# Altium schematic sheet sheet4_buttons_and_leds.SchDoc: Buttons and LEDs
size A3; Organization: Nordic Semiconductor; DocumentNumber: 4; SheetNumber: 4; SheetTotal: 6; CompanyName: Nordic Semiconductor; DocumentSize: A3
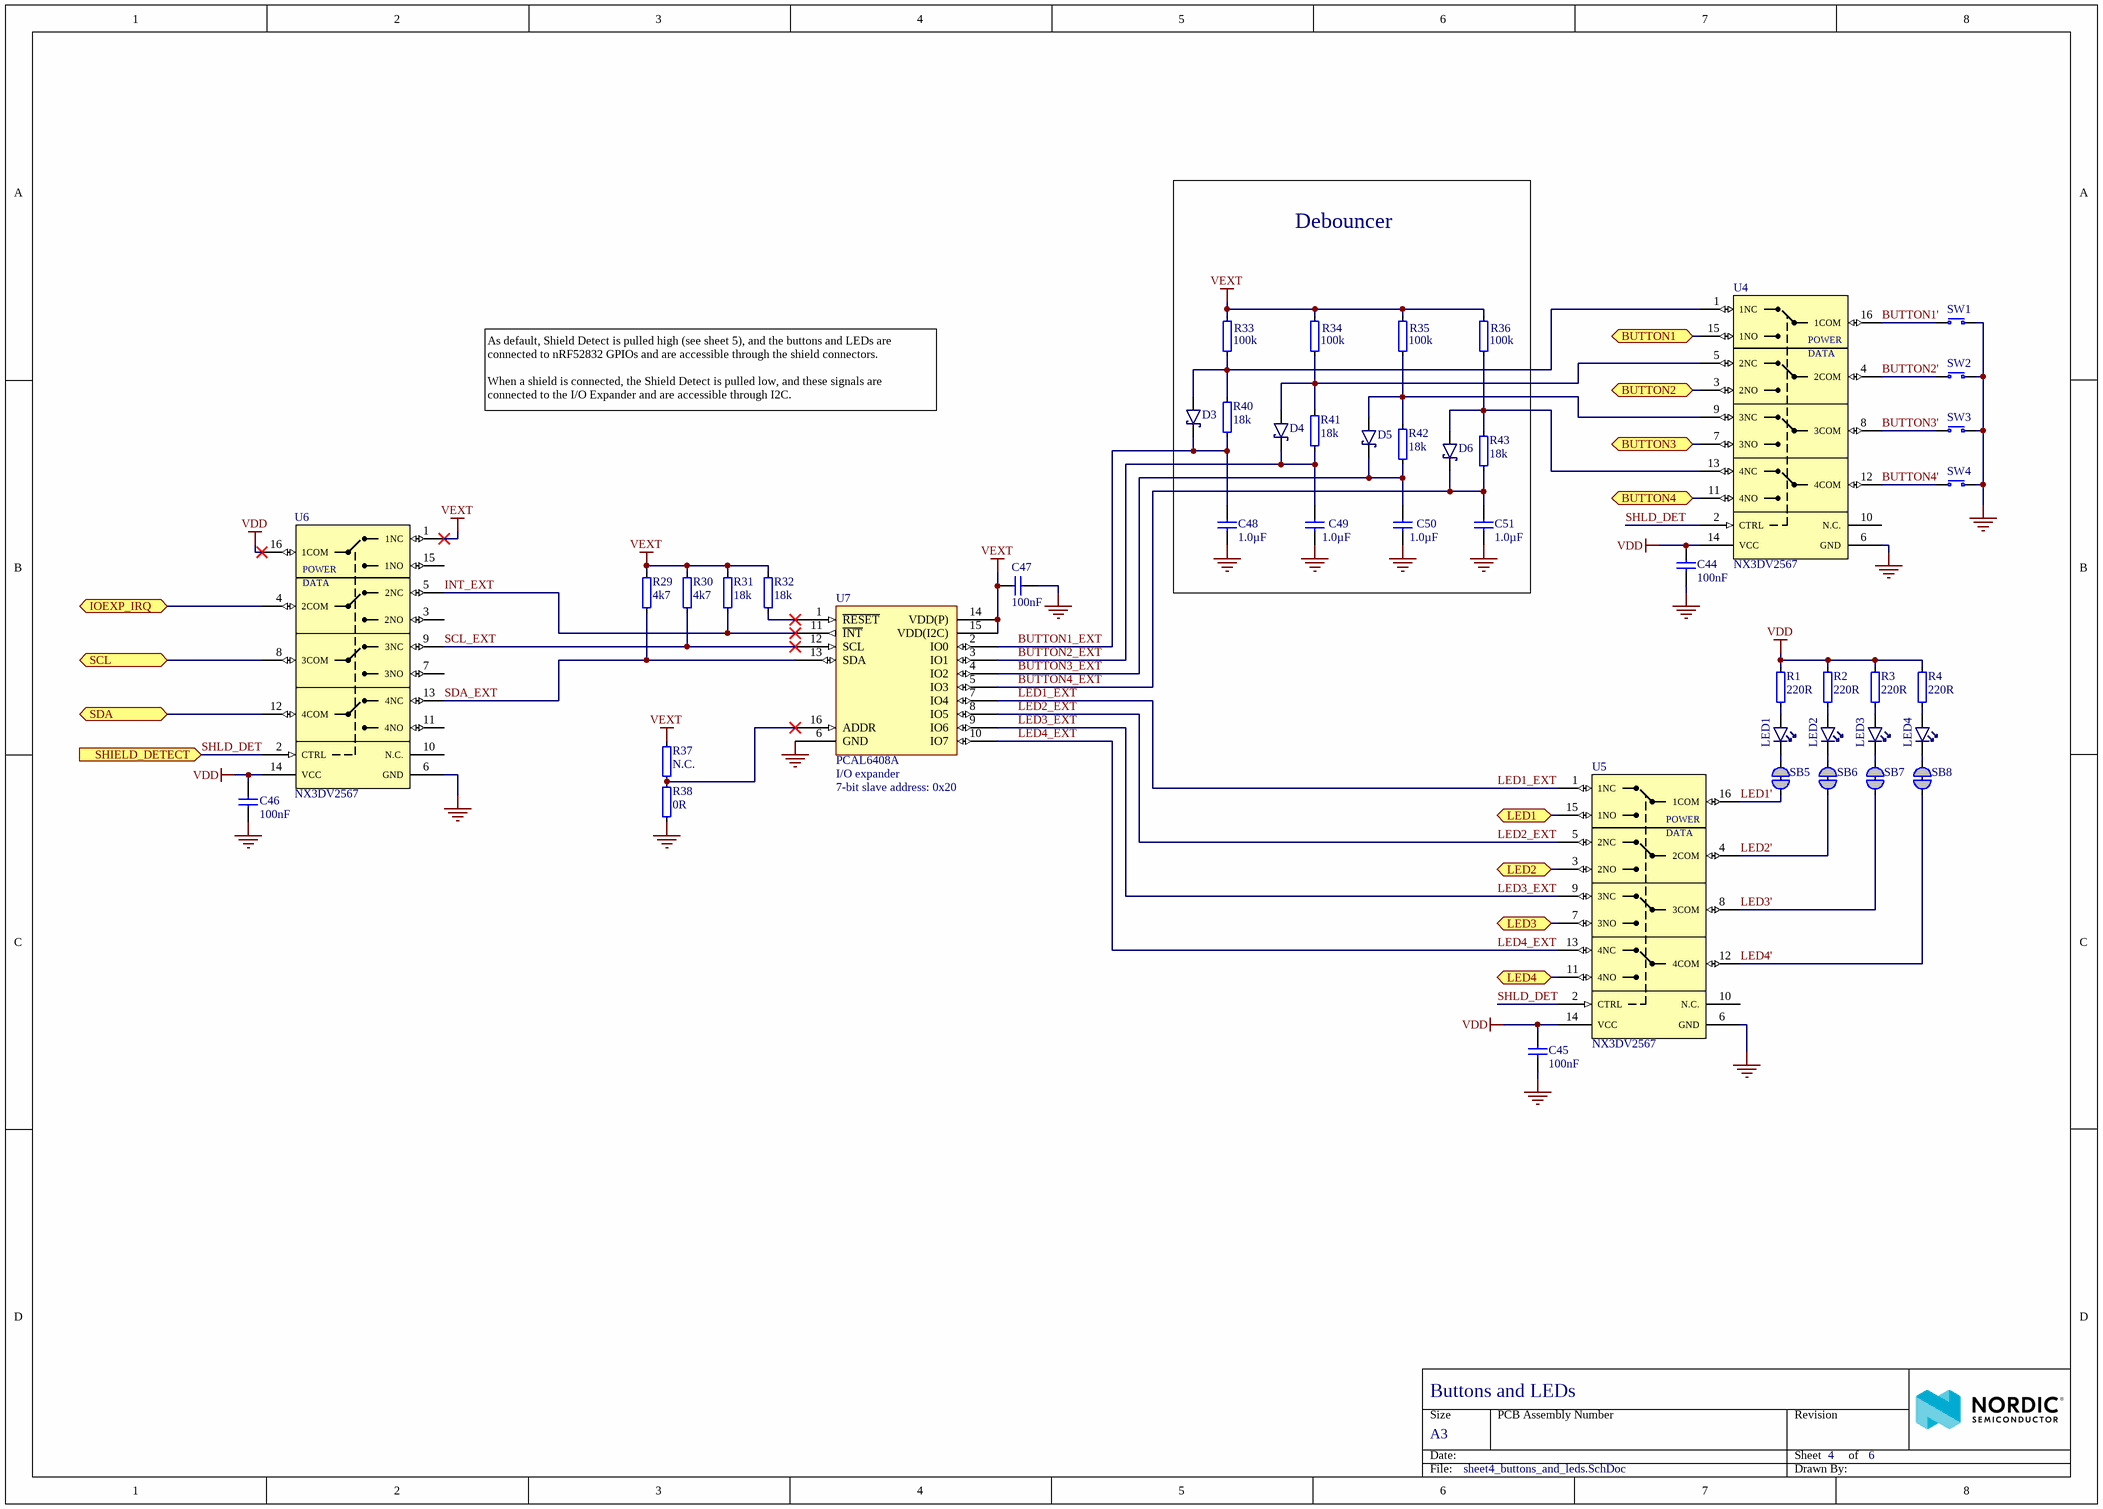
[diagram p0: sheet4_buttons_and_leds.SchDoc]

## Parts
C44  100nF  [CAPC1005X04L]
C45  100nF  [CAPC1005X04L]
C46  100nF  [CAPC1005X04L]
C47  100nF  [CAPC1005X04L]
C48  1.0µF  [CAPC1005X04L]
C49  1.0µF  [CAPC1005X04L]
C50  1.0µF  [CAPC1005X04L]
C51  1.0µF  [CAPC1005X04L]
D3  1PS79SB30.115  [SOD-523]  (value not drawn)
D4  1PS79SB30.115  [SOD-523]  (value not drawn)
D5  1PS79SB30.115  [SOD-523]  (value not drawn)
D6  1PS79SB30.115  [SOD-523]  (value not drawn)
LED1  L0603G  [LED_0603_G]  (value not drawn)
LED2  L0603G  [LED_0603_G]  (value not drawn)
LED3  L0603G  [LED_0603_G]  (value not drawn)
LED4  L0603G  [LED_0603_G]  (value not drawn)
R1  220R  [RESC1005X04L]
R2  220R  [RESC1005X04L]
R3  220R  [RESC1005X04L]
R4  220R  [RESC1005X04L]
R29  4k7  [RESC1005X04L]
R30  4k7  [RESC1005X04L]
R31  18k  [RESC1005X04L]
R32  18k  [RESC1005X04L]
R33  100k  [RESC1005X04L]
R34  100k  [RESC1005X04L]
R35  100k  [RESC1005X04L]
R36  100k  [RESC1005X04L]
R37  N.C.  [RESC1005X04L_NC]
R38  0R  [RESC1005X04L]
R40  18k  [RESC1005X04L]
R41  18k  [RESC1005X04L]
R42  18k  [RESC1005X04L]
R43  18k  [RESC1005X04L]
SB5  Solderbridge  [Solderbridge_Shorted]  (value not drawn)  (net tie, no BOM)
SB6  Solderbridge  [Solderbridge_Shorted]  (value not drawn)  (net tie, no BOM)
SB7  Solderbridge  [Solderbridge_Shorted]  (value not drawn)  (net tie, no BOM)
SB8  Solderbridge  [Solderbridge_Shorted]  (value not drawn)  (net tie, no BOM)
SW1  PB SW  [Switch-PB-6.2x6.3mm-SMD]  (value not drawn)
SW2  PB SW  [Switch-PB-6.2x6.3mm-SMD]  (value not drawn)
SW3  PB SW  [Switch-PB-6.2x6.3mm-SMD]  (value not drawn)
SW4  PB SW  [Switch-PB-6.2x6.3mm-SMD]  (value not drawn)
U4  NX3DV2567  [XQFN40P180X260X50-16N]
U5  NX3DV2567  [XQFN40P180X260X50-16N]
U6  NX3DV2567  [XQFN40P180X260X50-16N]
U7  PCAL6408A  [XQFN40P180X260X50-16N]

## Blocks framed on the sheet
Debouncer: C48-C51 D3-D6 R33-R36 R40-R43

## Ports
BUTTON1 (bidir), BUTTON2 (bidir), BUTTON3 (bidir), BUTTON4 (bidir), IOEXP_IRQ (bidir), LED1 (bidir), LED2 (bidir), LED3 (bidir), LED4 (bidir), SCL (bidir), SDA (bidir), SHIELD_DETECT (in)

## Nets
GND: C44.1 C45.1 C46.1 C47.1 C48.2 C49.1 C50.1 C51.2 R38.1 SW1.1(N.O) SW2.1(N.O) SW3.1(N.O) SW4.1(N.O) U4.6(GND) U5.6(GND) U6.6(GND) U7.6(GND)
VDD: C44.2 C45.2 C46.2 R1.2 R2.2 R3.2 R4.2 U4.14(VCC) U5.14(VCC) U6.14(VCC) U6.16(1COM)
VEXT: C47.2 R29.2 R30.2 R31.2 R32.2 R33.2 R34.2 R35.2 R36.2 R37.2 U6.1(1NC) U7.14(VDD(P)) U7.15(VDD(I2C))
BUTTON1: U4.15(1NO) ; port BUTTON1
BUTTON1': SW1.2(COM) U4.16(1COM)
BUTTON1_EXT: C48.1 D3.3(C) R40.1 U7.2(IO0)
BUTTON2: U4.3(2NO) ; port BUTTON2
BUTTON2': SW2.2(COM) U4.4(2COM)
BUTTON2_EXT: C49.2 D4.3(C) R41.1 U7.3(IO1)
BUTTON3: U4.7(3NO) ; port BUTTON3
BUTTON3': SW3.2(COM) U4.8(3COM)
BUTTON3_EXT: C50.2 D5.3(C) R42.1 U7.4(IO2)
BUTTON4: U4.11(4NO) ; port BUTTON4
BUTTON4': SW4.2(COM) U4.12(4COM)
BUTTON4_EXT: C51.1 D6.3(C) R43.1 U7.5(IO3)
INT_EXT: R31.1 U6.5(2NC) U7.11(~{INT})
IOEXP_IRQ: U6.4(2COM) ; port IOEXP_IRQ
LED1: U5.15(1NO) ; port LED1
LED1': SB5.1 U5.16(1COM)
LED1_EXT: U5.1(1NC) U7.7(IO4)
LED2: U5.3(2NO) ; port LED2
LED2': SB6.1 U5.4(2COM)
LED2_EXT: U5.5(2NC) U7.8(IO5)
LED3: U5.7(3NO) ; port LED3
LED3': SB7.1 U5.8(3COM)
LED3_EXT: U5.9(3NC) U7.9(IO6)
LED4: U5.11(4NO) ; port LED4
LED4': SB8.1 U5.12(4COM)
LED4_EXT: U5.13(4NC) U7.10(IO7)
SCL: U6.8(3COM) ; port SCL
SCL_EXT: R30.1 U6.9(3NC) U7.12(SCL)
SDA: U6.12(4COM) ; port SDA
SDA_EXT: R29.1 U6.13(4NC) U7.13(SDA)
SHLD_DET: U4.2(CTRL) U5.2(CTRL) U6.2(CTRL) ; port SHIELD_DETECT
NetD3_1: D3.1(A) R33.1 R40.2 U4.1(1NC)
NetD4_1: D4.1(A) R34.1 R41.2 U4.5(2NC)
NetD5_1: D5.1(A) R35.1 R42.2 U4.9(3NC)
NetD6_1: D6.1(A) R36.1 R43.2 U4.13(4NC)
NetLED1_1: LED1.1(C) SB5.2
NetLED1_2: LED1.2(A) R1.1
NetLED2_1: LED2.1(C) SB6.2
NetLED2_2: LED2.2(A) R2.1
NetLED3_1: LED3.1(C) SB7.2
NetLED3_2: LED3.2(A) R3.1
NetLED4_1: LED4.1(C) SB8.2
NetLED4_2: LED4.2(A) R4.1
NetR32_1: R32.1 U7.1(~{RESET})
NetR37_1: R37.1 R38.2 U7.16(ADDR)

Not connected (* = marked no-connect by the designer): U4 10(N.C.); U5 10(N.C.); U6 3(2NO) 7(3NO) 10(N.C.) 11(4NO) 15(1NO)

## Notes on the sheet
- As default, Shield Detect is pulled high (see sheet 5), and the buttons and LEDs are connected to nRF52832 GPIOs and are accessible through the shield connectors.
  When a shield is connected, the Shield Detect is pulled low, and these signals are connected to the I/O Expander and are accessible through I2C.
- (near U7) I/O expander
- (near U7) 7-bit slave address: 0x20
- Size
- Date:
- A3
- PCB Assembly Number
- Sheet         of
- Revision
- File:
- Drawn By:
- (in symbol NX3DV2567GU) POWER; DATA

## Library data of the parts
C44-C47 = C0402-100n: Capacitor, X7R, ±10%; Manufacturer: N.A.; Part number IPS: 00000005296; Note: 16V; Artikkelnr Noca: 20039200; Pad Count: 2; Part Number: C0402-100n; Manufacturer Part Number: N.A.; Footprint Doc: 0402; LatestRevisionDate: 2009-11-23; Published: 2009-05-08; Value: 100nF; ComponentLink1URL: N.A.; ComponentLink1Description: Datasheet; ComponentLink2URL: N.A.; ComponentLink2Description: Supplier link; HelpURL: N.A.; Supplier 1: N.A.; Supplier Part Number 1: N.A.; Supplier 2: N.A.; Supplier Part Number 2: N.A.; PartId: 100200184; Component Class: Capacitors; Author: rsk; Part number Norautron: N.A.
C48-C51 = C0402-1µ0: Capacitor, X5R, ±5%, 6.3V; Manufacturer: N.A.; Part number IPS: 00000007786, 00000003457; Artikkelnr Noca: 20039235; Pad Count: 2; Part Number: C0402-1µ0; Manufacturer Part Number: N.A.; Footprint Doc: 0402; LatestRevisionDate: 2016-08-22; Published: 2009-05-08; Value: 1.0µF; Note: 6.3V; ComponentLink1URL: N.A.; ComponentLink1Description: Datasheet; ComponentLink2URL: N.A.; ComponentLink2Description: Supplier link; HelpURL: N.A.; Supplier 1: Digi-Key; Supplier Part Number 1: 1276-1444-1-ND; Supplier 2: N.A.; Supplier Part Number 2: N.A.; PartId: 100200190; Component Class: Capacitors; Author: rsk; Part number Norautron: N.A.
D3-D6 = 1PS79SB30.115: Diode Schottky Vf=0.38, Vr=40V, If=200mA, Ir=500nA; Manufacturer: NXP Semiconductors; Note: N.A.; Artikkelnr Noca: 10029120; Pad Count: 2; Part Number: 1PS79SB30.115; Manufacturer Part Number: 1PS79SB30.115; Footprint Doc: SOD-523; LatestRevisionDate: 2016-08-26; Published: 2014-09-24; Value: 1PS79SB30.115; Part number IPS: N.A.; ComponentLink1URL: N.A.; ComponentLink1Description: Datasheet; ComponentLink2URL: N.A.; ComponentLink2Description: Supplier link; HelpURL: http://www.nxp.com/documents/data_sheet/1PS79SB30.pdf; Supplier 1: Digi-Key; Supplier Part Number 1: 568-5973-1-ND; Supplier 2: Farnell; Supplier Part Number 2: 873-4097; PartId: 101300094; Component Class: Semiconductors; Author: rsk; Part number Norautron: N.A.
LED1-LED4 = LG L29K Smartled Green: LED, Green, 0603, 570nm, Vf=1.7V, 2.24..5.6mcd, - 40 to +100°C; Manufacturer: Osram; Manufacturer Part Number: LG L29K-G2J1-24-Z; Part number IPS: 00000009961; Part number Norautron: N.A.; Note: 2.24..5.6 mcd, Vfmin=1.7V; Artikkelnr Noca: 13019147; Pad Count: 2; Part Number: LG L29K Smartled Green; Footprint Doc: 0603; LatestRevisionDate: 2017-08-21; Published: 2014-10-28; Value: L0603G; ComponentLink1URL: N.A.; ComponentLink1Description: Datasheet; ComponentLink2URL: N.A.; ComponentLink2Description: Supplier link; HelpURL: http://www.osram-os.com/Graphics/XPic2/00077107_0.pdf; Supplier 1: Digi-Key; Supplier Part Number 1: 475-2709-1-ND; Supplier 2: Mouser; Supplier Part Number 2: 720-LGL29KG2J124Z; PartId: 101400096; Component Class: Optoelectronics; Author: rsk
R1-R4 = R0402-220: Resistor, ±1%, 0.063W; Manufacturer: N.A.; Note: Chip Res 1%; Artikkelnr Noca: 27049057; Pad Count: 2; Part Number: R0402-220; Manufacturer Part Number: N.A.; LatestRevisionDate: 2009-11-23; Published: 2009-05-08; Value: 220R; Footprint Doc: 0402; Part number IPS: N.A.; ComponentLink1URL: N.A.; ComponentLink1Description: Datasheet; ComponentLink2URL: N.A.; ComponentLink2Description: Supplier link; HelpURL: N.A.; Supplier 1: Farnell; Supplier Part Number 1: 173-8841; Supplier 2: N.A.; Supplier Part Number 2: N.A.; PartId: 100100156; Component Class: Resistors; Author: rsk; Part number Norautron: N.A.
R29 R30 = R0402-4k7: Resistor, ±1%, 0.063W; Manufacturer: N.A.; Part number IPS: 00000003433; Note: Chip Res 1%; Artikkelnr Noca: 27049089; Pad Count: 2; Part Number: R0402-4k7; Manufacturer Part Number: N.A.; Footprint Doc: 0402; LatestRevisionDate: 2009-11-23; Published: 2009-05-08; Value: 4k7; ComponentLink1URL: N.A.; ComponentLink1Description: Datasheet; ComponentLink2URL: N.A.; ComponentLink2Description: Supplier link; HelpURL: N.A.; Supplier 1: Farnell; Supplier Part Number 1: 173-8858; Supplier 2: N.A.; Supplier Part Number 2: N.A.; PartId: 100100190; Component Class: Resistors; Author: rsk; Part number Norautron: N.A.
R31 R32 R40-R43 = R0402-18k: Resistor, ±1%, 0.063W; Manufacturer: N.A.; Part number IPS: 00000003300; Note: Chip Res 1%; Artikkelnr Noca: 27049103; Pad Count: 2; Part Number: R0402-18k; Manufacturer Part Number: N.A.; Footprint Doc: 0402; LatestRevisionDate: 2009-11-23; Published: 2009-05-08; Value: 18k; ComponentLink1URL: N.A.; ComponentLink1Description: Datasheet; ComponentLink2URL: N.A.; ComponentLink2Description: Supplier link; HelpURL: N.A.; Supplier 1: Farnell; Supplier Part Number 1: 173-8867; Supplier 2: N.A.; Supplier Part Number 2: N.A.; PartId: 100100208; Component Class: Resistors; Author: rsk; Part number Norautron: N.A.
R33-R36 = R0402-100k: Resistor, ±1%, 0.063W; Manufacturer: N.A.; Part number IPS: 00000003667; Note: Chip Res 1%; Artikkelnr Noca: 27049121; Pad Count: 2; Part Number: R0402-100k; Manufacturer Part Number: N.A.; Footprint Doc: 0402; LatestRevisionDate: 2009-11-23; Published: 2009-05-08; Value: 100k; ComponentLink1URL: N.A.; ComponentLink1Description: Datasheet; ComponentLink2URL: N.A.; ComponentLink2Description: Supplier link; HelpURL: N.A.; Supplier 1: Farnell; Supplier Part Number 1: 173-8877; Supplier 2: N.A.; Supplier Part Number 2: N.A.; PartId: 100100239; Component Class: Resistors; Author: rsk; Part number Norautron: N.A.
R37 = R0402-N.C.: Not mounted; Manufacturer: N.A.; Note: Chip Res; Assembly: Not mounted; Pad Count: 2; Part Number: R0402-N.C.; Manufacturer Part Number: N.A.; Footprint Doc: 0402; LatestRevisionDate: 2009-05-08; Published: 2009-05-08; Value: N.C.; Artikkelnr Noca: N.A.; Part number IPS: N.A.; ComponentLink1URL: N.A.; ComponentLink1Description: Datasheet; ComponentLink2URL: N.A.; ComponentLink2Description: Supplier link; HelpURL: N.A.; Supplier 1: N.A.; Supplier Part Number 1: N.A.; Supplier 2: N.A.; Supplier Part Number 2: N.A.; PartId: 100100281; Component Class: Resistors; Author: rsk; Part number Norautron: N.A.
R38 = R0402-0R: Resistor, ±5%, 0.063W; Manufacturer: N.A.; Part number IPS: 00000007128; Note: Chip Res 5%; Artikkelnr Noca: 27049000; Pad Count: 2; Part Number: R0402-0R; Manufacturer Part Number: N.A.; Footprint Doc: 0402; LatestRevisionDate: 2009-11-23; Published: 2009-05-08; Value: 0R; ComponentLink1URL: N.A.; ComponentLink1Description: Datasheet; ComponentLink2URL: N.A.; ComponentLink2Description: Supplier link; HelpURL: N.A.; Supplier 1: Farnell; Supplier Part Number 1: 146-9661; Supplier 2: N.A.; Supplier Part Number 2: N.A.; PartId: 100100109; Component Class: Resistors; Author: rsk; Part number Norautron: N.A.
SB5-SB8 = Solderbridge Shorted: Shorted Solderbridge; Manufacturer: N.A.; Pad Count: 2; Part Number: Solderbridge Shorted; Manufacturer Part Number: N.A.; LatestRevisionDate: 2012-08-07; Published: 2012-08-07; Value: Solderbridge; Note: N.A.; Artikkelnr Noca: N.A.; Footprint Doc: Solderbridge_Shorted; Part number IPS: N.A.; ComponentLink1URL: N.A.; ComponentLink1Description: Datasheet; ComponentLink2URL: N.A.; ComponentLink2Description: Supplier link; HelpURL: N.A.; Supplier 1: N.A.; Supplier Part Number 1: N.A.; Supplier 2: N.A.; Supplier Part Number 2: N.A.; PartId: 100500459; Component Class: Connectors; Author: rsk; Part number Norautron: N.A.
SW1-SW4 = Switch-PB-6.2x6.3mm-SMD: Tactile Switch, SPNO, SMD, 160gf, 6.2x6.3x2.5mm; Manufacturer: Dailywell; Manufacturer Part Number: TS604VM1-025BR-R; Part number IPS: 00000007812; Note: N.A.; Artikkelnr Noca: 50019106; Pad Count: 4; Part Number: Switch-PB-6.2x6.3mm-SMD; Footprint Doc: Switch-PB-6.2x6.3mm-SMD; LatestRevisionDate: 2016-04-21; Published: 2010-02-01; Value: PB SW; ComponentLink1URL: N.A.; ComponentLink1Description: Datasheet; ComponentLink2URL: N.A.; ComponentLink2Description: Supplier link; HelpURL: \\hizz\pro\app9717\Datasheet\switches\Dailywell\TS604VM1-025BR-R.pdf; Supplier 1: Cabcon; Supplier Part Number 1: TS604VM1-025BR-R; Supplier 2: Mouser; Supplier Part Number 2: 688-SKHUALE010; PartId: 101500001; Component Class: Switches; Author: rsk; Part number Norautron: N.A.
U4-U6 = NX3DV2567GU: Low-ohmic four-pole double-throw analog switch; Manufacturer: NXP Semiconductors; Part number IPS: 00000007816; Pad Count: 16; Note: N.A.; Artikkelnr Noca: 15079317; Part Number: NX3DV2567GU; PartId: 101900290; Component Class: Misc_ICs; Author: rsk; Manufacturer Part Number: NX3DV2567GU; ComponentLink1URL: N.A.; ComponentLink1Description: Datasheet; ComponentLink2URL: N.A.; ComponentLink2Description: Supplier link; HelpURL: http://www.nxp.com/documents/data_sheet/NX3DV2567.pdf; Footprint Doc: XQFN-16; LatestRevisionDate: 2015-02-17; Published: 2015-02-17; Value: NX3DV2567; Supplier 1: Digi-Key; Supplier Part Number 1: 568-5206-1-ND; Supplier 2: Mouser; Supplier Part Number 2: 771-NX3DV2567GU115; Part number Norautron: N.A.
U7 = PCAL6408AHK: 8-bit I2C-bus I/O expander with interrupt output; Manufacturer: NXP Semiconductors; Part number IPS: 00000009987; Note: N.A.; Artikkelnr Noca: 15079321; Pad Count: 16; Part Number: PCAL6408AHK; Manufacturer Part Number: PCAL6408AHK; Footprint Doc: XQFN-16; LatestRevisionDate: 2015-04-29; Published: 2015-04-29; Value: PCAL6408A; ComponentLink1URL: N.A.; ComponentLink1Description: Datasheet; ComponentLink2URL: N.A.; ComponentLink2Description: Supplier link; HelpURL: http://www.nxp.com/documents/data_sheet/PCAL6408A.pdf; Supplier 1: Digi-Key; Supplier Part Number 1: 568-9944-1-ND; Supplier 2: Mouser; Supplier Part Number 2: 771-PCAL6408AHKX; PartId: 101900289; Component Class: Misc_ICs; Author: rsk; Part number Norautron: N.A.